# Altium schematic sheet 5ch Receiver.SchDoc
size 297 x 209 mm; SheetNumber: 6; SheetTotal: 11
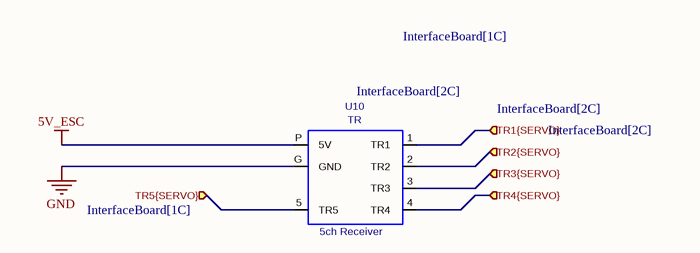
[diagram p0: 5ch Receiver.SchDoc]

## Parts
U10  TR  [5Ch_Reciever]

## Ports
TR1{SERVO} (in, see InterfaceBoard[2C]), TR2{SERVO} (in, see InterfaceBoard[2C]), TR3{SERVO} (in, see InterfaceBoard[2C]), TR4{SERVO} (in, see InterfaceBoard[1C]), TR5{SERVO} (in, see InterfaceBoard[1C])

## Nets
5V_ESC: U10.P(5V)
GND: U10.G(GND)
TR1{SERVO}: U10.1(TR1) ; port TR1{SERVO}
TR2{SERVO}: U10.2(TR2) ; port TR2{SERVO}
TR3{SERVO}: U10.3(TR3) ; port TR3{SERVO}
TR4{SERVO}: U10.4(TR4) ; port TR4{SERVO}
TR5{SERVO}: U10.5(TR5) ; port TR5{SERVO}

## Notes on the sheet
- 1
- 2
- 3
- 4
- 5
- 6
- A
- B
- C
- D
- Title:
- File: Receiver.kicad_sch
- Sheet: /
- KiCad E.D.A.  kicad (5.1.4)-1
- Size: A4
- Date:
- Rev:
- Id: 1/1
- (in symbol TR) 5ch Receiver

## Library data of the parts
U10 = TR: Value: TR; Footprint: Sprite:TR